# EAGLE design SDCARD_33 (EAGLE 5.11)
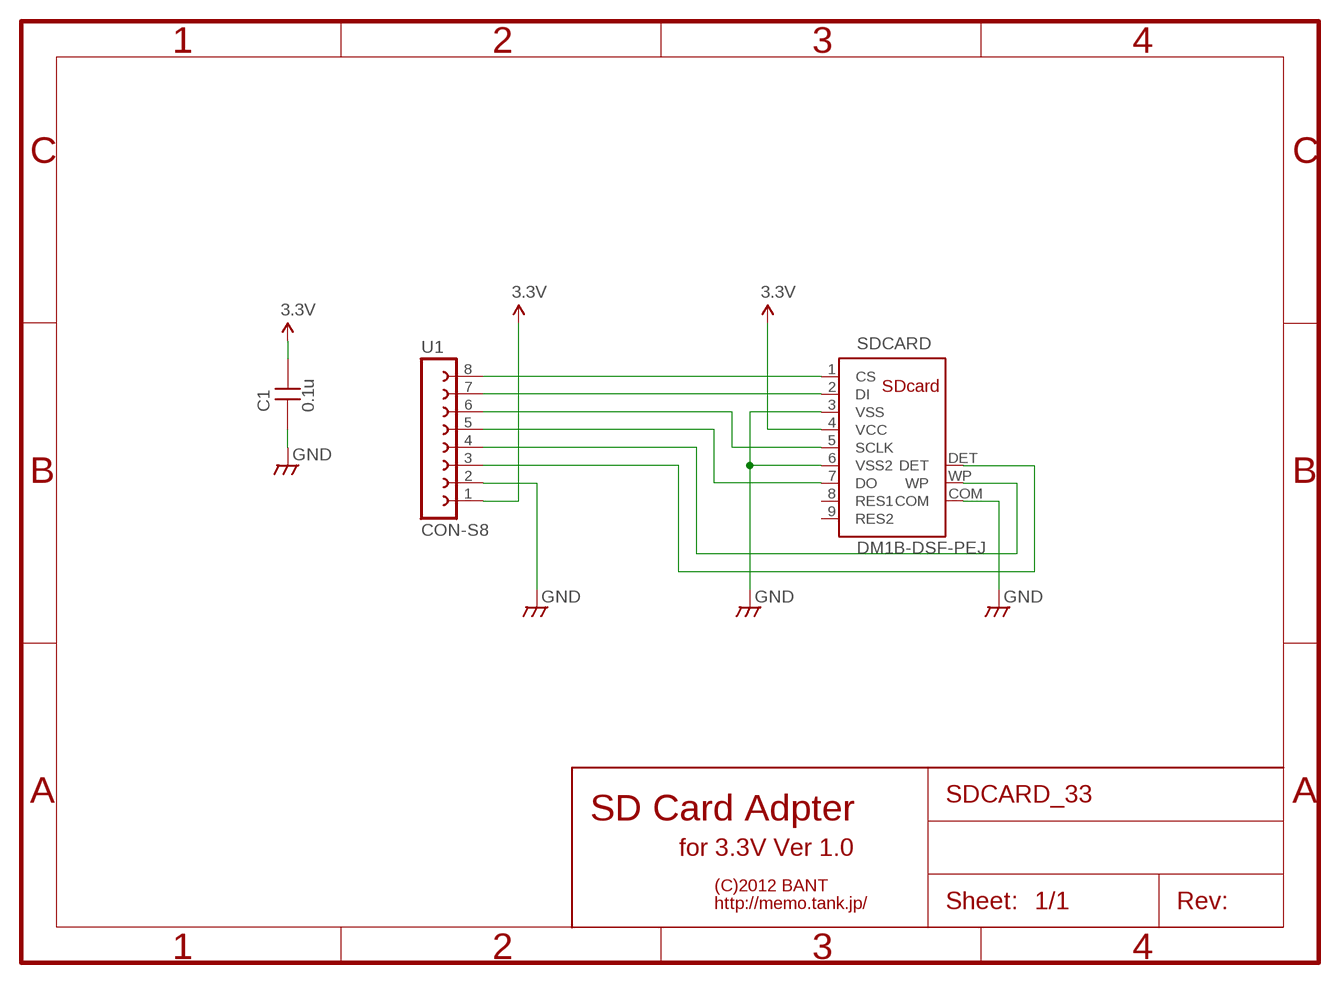
[diagram p0: schematic, sheet 1]

## Parts
C1  0.1u  CAPSM1608  [C1608]
SDCARD  DM1B-DSF-PEJ  [DM1B-DSF-PEJ]
U1  CON-S8  CON-S8-1  [CON-S8-1]

## Nets
3.3V: C1.2 SDCARD.4(VCC) U1.1
GND: C1.1 SDCARD.3(VSS) SDCARD.6(VSS2) SDCARD.COM U1.2
N$1: SDCARD.1(CS) U1.8
N$2: SDCARD.2(DI) U1.7
N$4: SDCARD.5(SCLK) U1.6
N$5: SDCARD.7(DO) U1.5
N$6: SDCARD.WP U1.4
N$7: SDCARD.DET U1.3
Unconnected: SDCARD.8(RES1) SDCARD.9(RES2)

## Notes on the sheet
- SD Card Adpter
- for 3.3V Ver 1.0
- (C)2012 BANT
- http://memo.tank.jp/

## Library data of the parts
C1 = MyLib:CAP: Non polar capacitor
SDCARD = sd-card:DM1B-DSF-PEJ: SDcard connector reverse type HIROSE
U1 = bant:CON-S8-1

## Board
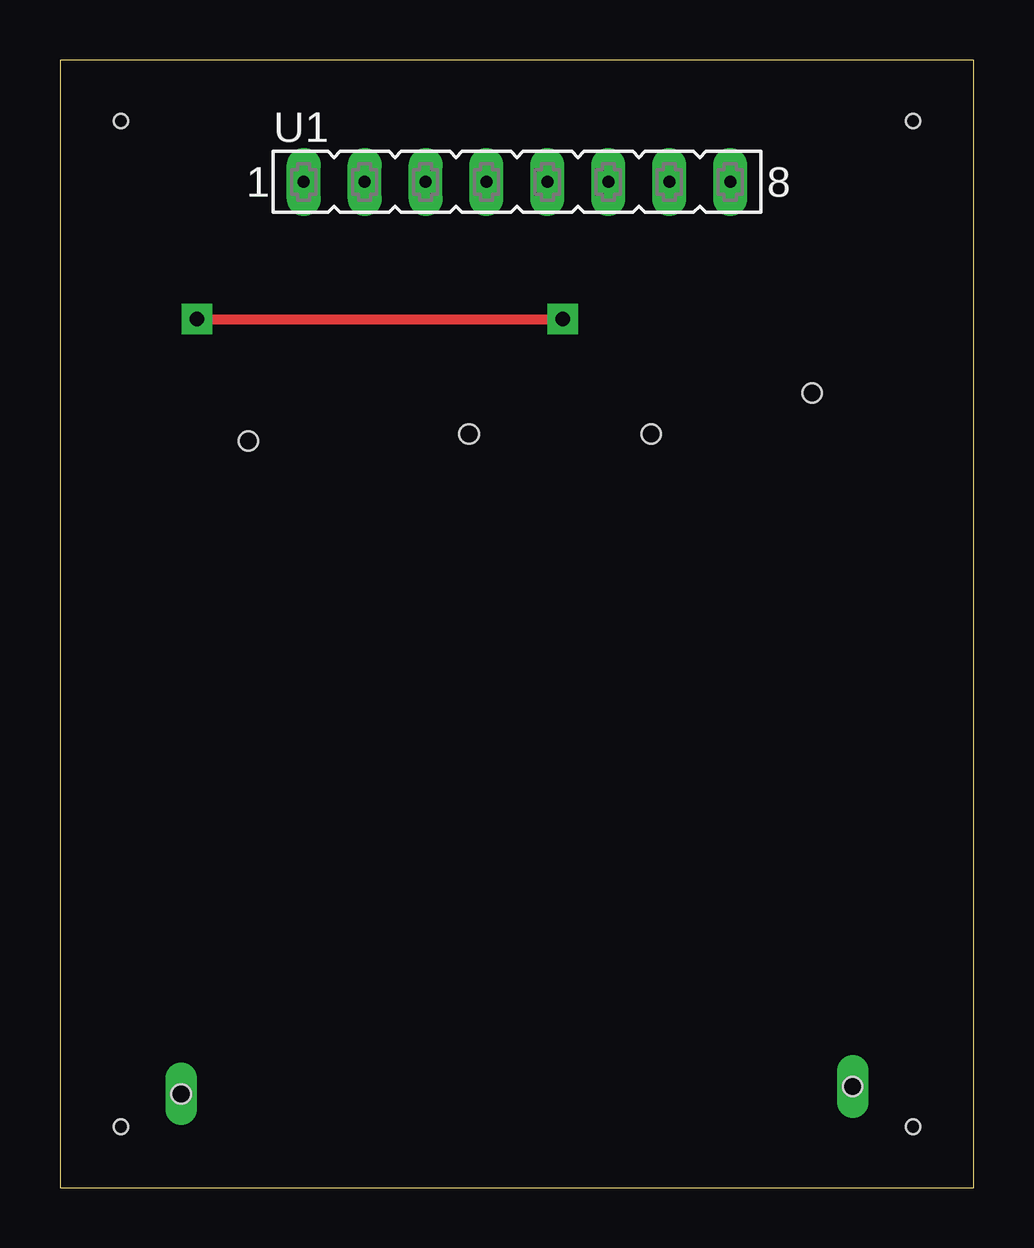
[diagram p1: board, top side]
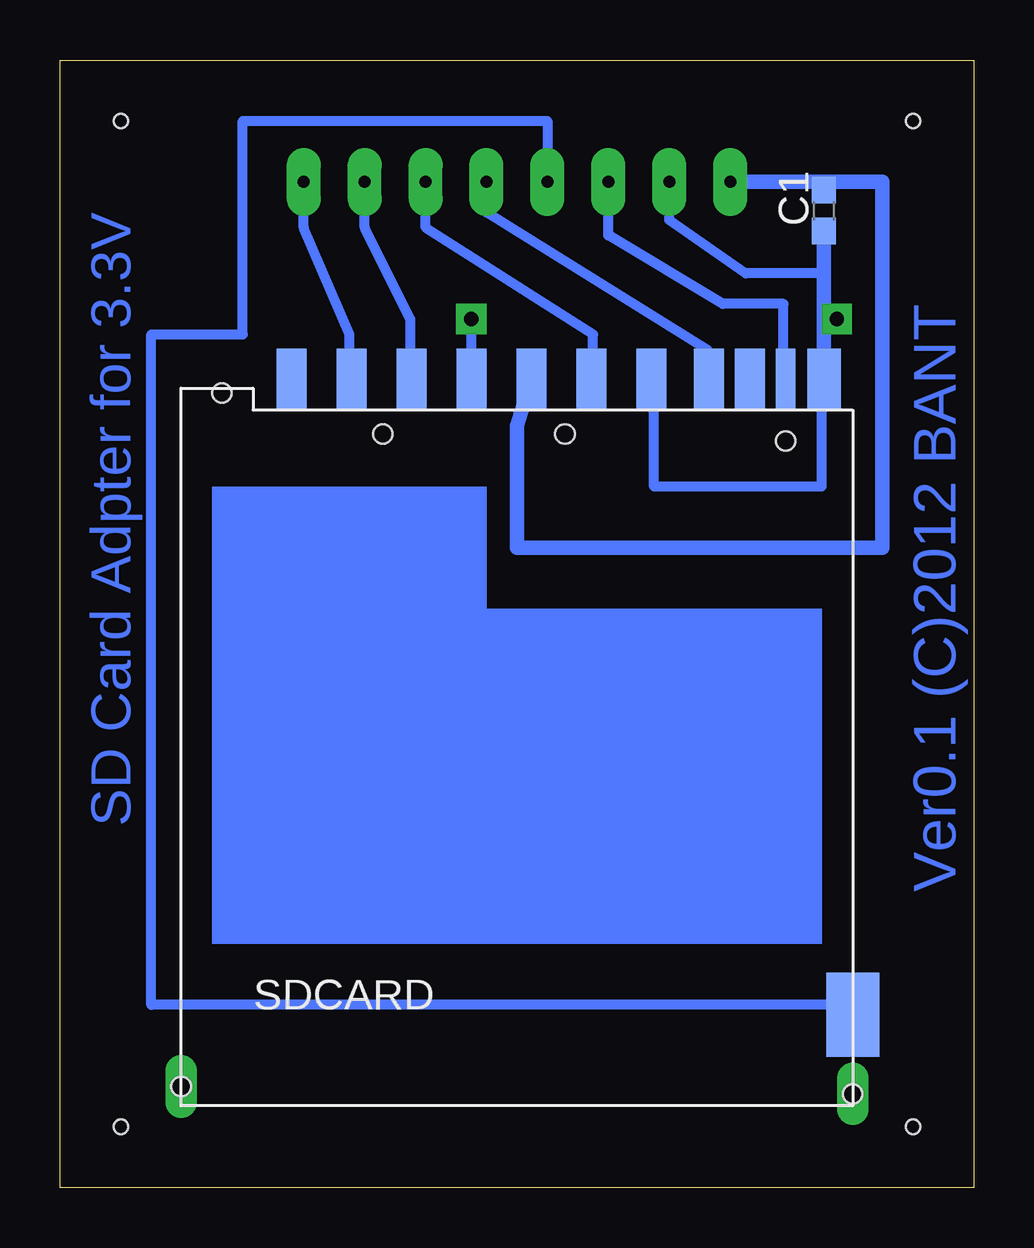
[diagram p2: board, bottom side, seen from below]

Size 38.1 x 46.99 mm. Coordinates in mm from the lower left corner, seen from the top.
Outline: 0,0 38.1,0 38.1,46.99 0,46.99 0,0
Copper layers (1*16): Top 0.035mm / dielectric 1.5mm / Bottom 0.035mm
Design rules "default": minimum track width 10mil, minimum drill 24mil, track to track 8mil, track to pad 8mil, pad to pad 8mil, via to via 8mil, smd to smd 8mil, copper to edge 40mil, drill to drill 8mil, minimum pad ring 10mil, minimum via ring 8mil, stop-mask expansion 4mil, vias tented up to drill 0mil, thermal gap 10mil
Holes 0.6 mm at 35.56,44.45 35.56,2.54 2.54,2.54 2.54,44.45

### Footprints (pad centres in the part's own frame; a part is rotated, then mirrored left to right if it is on the bottom)
C1608 = smd 1.1 x 1: 1 -0.85,0; 2 0.85,0
DM1B-DSF-PEJ = smd 1.25 x 2.5: 1 -6.9,15.3; 2 -4.4,15.3; 3 -1.9,15.3; 4 0.6,15.3; 5 3.1,15.3; 6 5.6,15.3; 7 8,15.3; 8 9.7,15.3; 9 -9.4,15.3 | smd 1.4 x 2.5: COM 12.8,15.3 | smd 0.8 x 2.5: DET 11.2,15.3 | drill 0.8 pad 1.2 long: P$17 14,-14.5 | drill 0.8 pad 1.27 long: P$18 -14,-14.2 | smd 2.2 x 3.5: WP 14,-11.2 | hole 0.8: -12.3,14.7; -5.6,13; 2,13; 11.2,12.7; -14,-14.2; 14,-14.5
CON-S8-1 = drill 0.5 pad 1.422 long: 1 -8.89,0; 2 -6.35,0; 3 -3.81,0; 4 -1.27,0; 5 1.27,0; 6 3.81,0; 7 6.35,0; 8 8.89,0

### Placement (x,y rotation side)
C1  6.25,40.72 90 bottom
SDCARD  19.05,18.41 0 bottom
U1  19.05,41.91 0 top

### Tracks (layer width: path | path; a pad name or v marks a point on that pad's centre or on a via)
3.3V
  Bottom 0.406: C1.2 6.35,41.57 6.35,41.91
  Bottom 0.61: SDCARD.4 19.05,31.75 19.05,26.67 3.81,26.67 3.81,41.91 6.35,41.91 U1.1
GND  (via drill 0.6 pad 1.27)
  Top 0.406: v5.71,36.2 v20.95,36.2
  Bottom 0.254: 13.34,33.02 SDCARD.6 | 6.35,33.02 SDCARD.COM
  Bottom 0.406: 13.34,33.02 13.34,29.21 6.35,29.21 6.35,33.02 | U1.2 12.7,40.32 9.53,38.1 6.25,38.1 | C1.1 | SDCARD.3 v20.95,36.2 | SDCARD.COM 6.25,33.66 | 6.25,36.2 v5.71,36.2
  Bottom 0.61: C1.1 6.25,38.1 6.25,36.2 SDCARD.COM
N$1
  Bottom 0.254: SDCARD.1 26.04,33.66
  Bottom 0.406: 26.04,33.66 26.04,35.56 27.94,40.01 U1.8
N$2
  Bottom 0.406: SDCARD.2 23.5,33.72 23.5,36.2 25.4,40.01 U1.7
N$4
  Bottom 0.406: SDCARD.5 15.88,33.08 15.88,35.56 22.86,40.01 U1.6
N$5
  Bottom 0.406: SDCARD.7 11.11,33.72 11.11,34.92 20.32,40.64 U1.5
N$6
  Bottom 0.254: SDCARD.WP 5.08,7.62
  Bottom 0.406: 5.08,7.62 34.29,7.62 34.29,35.56 30.48,35.56 30.48,44.45 17.78,44.45 U1.4
N$7
  Bottom 0.254: SDCARD.DET 7.94,33.66
  Bottom 0.406: 7.94,33.66 7.94,36.83 10.48,36.83 15.24,39.69 U1.3
(copper drawn outside any net)
  shapes: Bottom area x3

### Text on the board
Bottom: SD Card Adpter for 3.3V | Ver0.1 (C)2012 BANT